# EAGLE design flash_modchip (EAGLE 9.6.2)
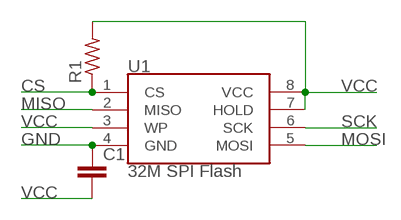
[diagram p0: schematic, sheet 1]

## Parts
C1  C-EUC0402  [C0402]
R1  R-US_R0402  [R0402]
U1  32M SPI Flash  SPI_FLASH-X25XXSMD  [SO08]

## Nets
CS: R1.1 U1.1(CS)
GND: C1.1 U1.4(GND)
MISO: U1.2(MISO)
MOSI: U1.5(MOSI)
SCK: U1.6(SCK)
VCC: C1.2 R1.2 U1.3(WP) U1.7(HOLD) U1.8(VCC)

## Library data of the parts
C1 = rcl:C-EU: CAPACITOR, European symbol; SPICEPREFIX: C
R1 = rcl:R-US_: RESISTOR, American symbol; SPICEPREFIX: R
U1 = SparkFun-IC-Memory:SPI_FLASH-X25XX: 32M Serial Flash Memory 8pin SPI Flash series x25xx. Works with devices like W25X32 and BR25L32 Datasheet <http://www.macronix.com/Lists/Datasheet/Attachments/5031/MX25L3206E,%203V,%2032Mb,%20v1.5.pdf> SparkFun Products SparkFun Venus GPS Logger <https://www.sparkfun.com/products/10920> (GPS-10920); PROD_ID: N/A

## Board
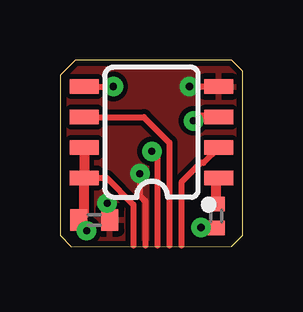
[diagram p1: board, top side]
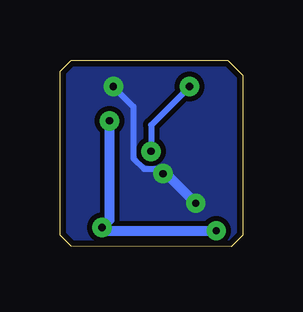
[diagram p2: board, bottom side, seen from below]

Size 7.62 x 7.77 mm. Coordinates in mm from the lower left corner, seen from the top.
Outline: 0,7.14 0,0.48 0.48,0 7.15,0 7.62,0.48 7.62,7.3 7.15,7.77 0.62,7.77 0,7.14
Copper layers (1*16): Top 0.035mm / dielectric 1.5mm / Bottom 0.035mm
Design rules "SparkFun *": minimum track width 8mil, minimum drill 0.3mm, track to track 8mil, track to pad 8mil, pad to pad 8mil, via to via 8mil, smd to smd 8mil, copper to edge 10mil, drill to drill 8mil, minimum pad ring 12mil, minimum via ring 10mil, stop-mask expansion 4mil, vias tented up to drill 25mil, thermal gap 10mil

### Footprints (pad centres in the part's own frame; a part is rotated, then mirrored left to right if it is on the bottom)
C0402 = smd 0.7 x 0.9: 1 -0.65,0; 2 0.65,0
R0402 = smd 0.6 x 0.7: 1 -0.5,0; 2 0.5,0
SO08 = smd 0.6 x 1.2: 1 -1.905,-2.8; 2 -0.635,-2.8; 3 0.635,-2.8; 4 1.905,-2.8; 5 1.905,2.8; 6 0.635,2.8; 7 -0.635,2.8; 8 -1.905,2.8

### Placement (x,y rotation side)
C1  1.43,1.11 180 top
R1  6.51,1.27 270 top
U1  3.81,4.76 90 top

### Tracks (layer width: path | path; a pad name or v marks a point on that pad's centre or on a via)
CS
  Top 0.406: R1.1 6.51,2.76 U1.1
GND  (via drill 0.3)
  Top 0.254: U1.4 v5.4,6.67 | v3.33,3.04 3.33,2.13 3.56,1.89 3.56,0.04
  Top 0.406: C1.1 2.08,1.69 v1.96,1.8
  Bottom 0.254: v3.33,3.04 3.52,3.23 4.13,3.23 4.56,3.66 4.56,5.83 v5.4,6.67
  Bottom 0.406: v1.96,1.8 3.2,3.04 v3.33,3.04
  pour Top: -0.16,7.94 7.78,7.94 7.78,-0.16 -0.16,-0.16
  pour Bottom: -0.16,7.94 7.78,7.94 7.78,-0.16 -0.16,-0.16
MISO
  Top 0.254: U1.2 5.97,3.49 5.87,3.49 5.06,2.67 5.06,0.04
MOSI  (via drill 0.3)
  Top 0.254: U1.5 v2.22,6.67 | v3.83,3.97 4.06,3.73 4.06,0.04
  Bottom 0.254: v2.22,6.67 3.83,5.06 v3.83,3.97
SCK
  Top 0.254: U1.6 3.49,5.4 4.56,4.33 4.56,0.04
VCC  (via drill 0.3)
  Top 0.254: 3.06,0.04 3.06,1.75 1.95,2.86 U1.8
  Top 0.406: U1.7 U1.8 1.01,1.34 C1.2 0.78,0.99 v1.11,0.66 | R1.2 5.9,0.77 v5.87,0.79 | v5.56,5.24 5.72,5.4 U1.3
  Bottom 0.406: v5.56,5.24 5.56,1.11 v5.87,0.79 5.74,0.66 v1.11,0.66